# EAGLE schematic Proto_shield_REV3 (EAGLE 7.1.0)
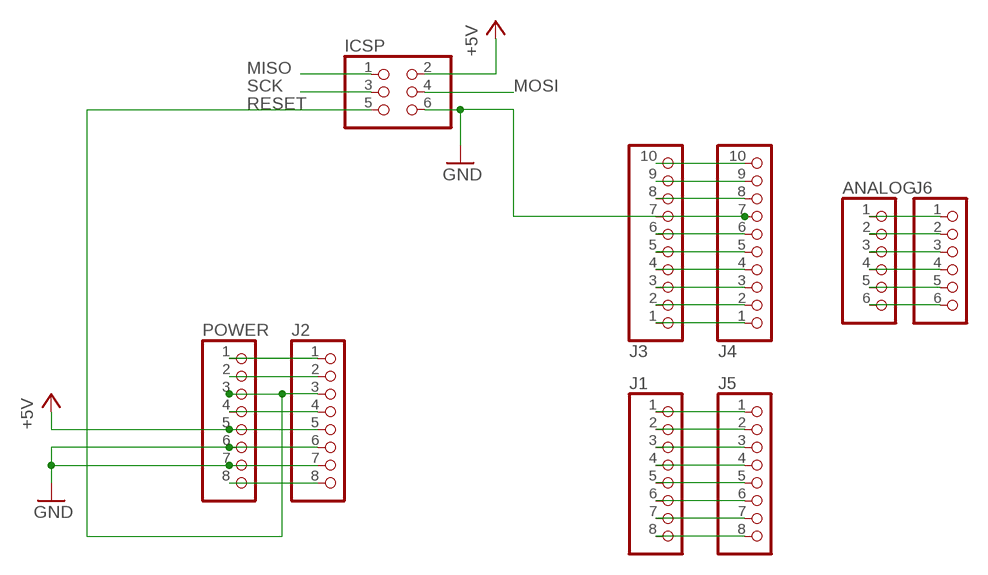
[diagram p0: schematic, sheet 1]

## Parts
ANALOG  PINHD-1X6  [1X06]
ICSP  PINHD-2X3  [2X03]
J1  PINHD-1X8TH  [1X08-TH]
J2  PINHD-1X8TH  [1X08-TH]
J3  PINHD-1X10TH  [1X10-TH]
J4  PINHD-1X10TH  [1X10-TH]
J5  PINHD-1X8TH  [1X08-TH]
J6  PINHD-1X6  [1X06]
POWER  PINHD-1X8TH  [1X08-TH]

## Nets
+5V: ICSP.2 J2.5 POWER.5
+9V: J2.8 POWER.8
GND: ICSP.6 J2.7 J3.7 J4.7 POWER.7
MISO: ICSP.1
MOSI: ICSP.4
N$1: J3.6 J4.6
N$2: J3.1 J4.1
N$3: J3.4 J4.4
N$4: J3.5 J4.5
N$6: J3.2 J4.2
N$7: J3.3 J4.3
N$8: J1.1 J5.1
N$9: J1.2 J5.2
N$10: J1.3 J5.3
N$11: J1.4 J5.4
N$12: J1.5 J5.5
N$13: J1.6 J5.6
N$14: J1.7 J5.7
N$15: J1.8 J5.8
N$18: ANALOG.1 J6.1
N$19: ANALOG.2 J6.2
N$20: ANALOG.3 J6.3
N$21: ANALOG.4 J6.4
N$22: ANALOG.5 J6.5
N$23: ANALOG.6 J6.6
N$25: J2.6 POWER.6
N$31: J2.2 POWER.2
N$32: J2.1 POWER.1
N$141: J3.9 J4.9
N$142: J3.10 J4.10
N$222: J3.8 J4.8
N$223: J2.4 POWER.4
RESET: ICSP.5 J2.3 POWER.3
SCK: ICSP.3

## Library data of the parts
ANALOG J6 = pinhead:PINHD-1X6: PIN HEADER
ICSP = SmartPrj:PINHD-2X3: PIN HEADER
J1 J2 J5 POWER = SmartPrj:PINHD-1X8: PIN HEADER
J3 J4 = SmartPrj:PINHD-1X10: PIN HEADER